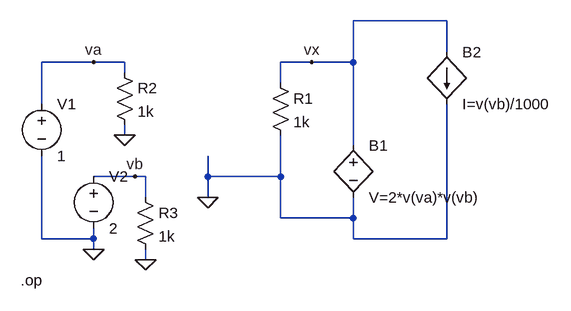
[diagram p0: schematic Behavioral.asc]
Behavioral.asc, the LTspice schematic file:
Version 4
SHEET 1 880 680
WIRE 576 -32 432 -32
WIRE 576 16 576 -32
WIRE 32 32 -48 32
WIRE 80 32 32 32
WIRE 368 32 320 32
WIRE 432 32 432 -32
WIRE 432 32 368 32
WIRE 80 48 80 32
WIRE 320 64 320 32
WIRE -48 96 -48 32
WIRE 80 144 80 128
WIRE 432 160 432 32
WIRE 96 208 32 208
WIRE 112 208 96 208
WIRE 208 208 208 176
WIRE 320 208 320 144
WIRE 320 208 208 208
WIRE 112 240 112 208
WIRE 208 240 208 208
WIRE 320 272 320 208
WIRE 432 272 432 240
WIRE 432 272 320 272
WIRE -48 304 -48 176
WIRE 32 304 32 288
WIRE 32 304 -48 304
WIRE 432 304 432 272
WIRE 576 304 576 96
WIRE 576 304 432 304
WIRE 32 320 32 304
WIRE 112 336 112 320
FLAG 208 240 0
FLAG 80 144 0
FLAG 32 320 0
FLAG 112 336 0
FLAG 32 32 va
FLAG 96 208 vb
FLAG 368 32 vx
SYMBOL res 304 48 R0
SYMATTR InstName R1
SYMATTR Value 1k
SYMBOL voltage -48 80 R0
WINDOW 123 0 0 Left 2
WINDOW 39 0 0 Left 2
SYMATTR InstName V1
SYMATTR Value 1
SYMBOL voltage 32 192 R0
WINDOW 123 0 0 Left 2
WINDOW 39 0 0 Left 2
SYMATTR InstName V2
SYMATTR Value 2
SYMBOL res 64 32 R0
SYMATTR InstName R2
SYMATTR Value 1k
SYMBOL res 96 224 R0
SYMATTR InstName R3
SYMATTR Value 1k
SYMBOL bv 432 144 R0
SYMATTR InstName B1
SYMATTR Value V=2*v(va)*v(vb)
SYMBOL bi 576 16 R0
SYMATTR InstName B2
SYMATTR Value I=v(vb)/1000
TEXT -80 368 Left 2 !.op

The netlist it stands for:
* Behavioral.asc
R1 vx 0 1k
V1 va 0 1
V2 vb 0 2
R2 va 0 1k
R3 vb 0 1k
B1 vx 0 V=2*v(va)*v(vb)
B2 vx 0 I=v(vb)/1000
.op
.backanno
.end